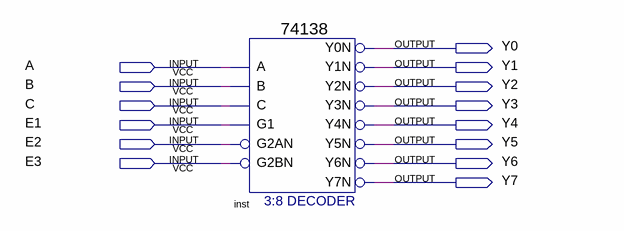
[diagram p0: schematic sheet]
// Quartus schematic sim74138.bdf as structural Verilog: 1 symbols, 14 pins
module sim74138 (
  input  A,
  input  B,
  input  C,
  input  E1,
  input  E2,
  input  E3,
  output Y0,
  output Y1,
  output Y2,
  output Y3,
  output Y4,
  output Y5,
  output Y6,
  output Y7
);

  \74138  inst (
    .A(A), .B(B), .G1(E1), .C(C), .G2AN(E2), .G2BN(E3), .Y0N(Y0), .Y1N(Y1), .Y2N(Y2), .Y3N(Y3), .Y4N(Y4),
    .Y5N(Y5), .Y6N(Y6), .Y7N(Y7));
endmodule
